# Altium schematic sheet LCD.SchDoc: LCD Interface
size A3; Author: P.A.; CompanyName: STMicroelectronics; Organization: Microcontrollers Division; Address1: 12, Rue Jules HOROWITZ; Address2: 38019 Grenoble; Address3: FRANCE; DocumentNumber: MB1261; Revision: B.01; SheetNumber: 9; SheetTotal: 15; Project: STM32L496G-DISCO
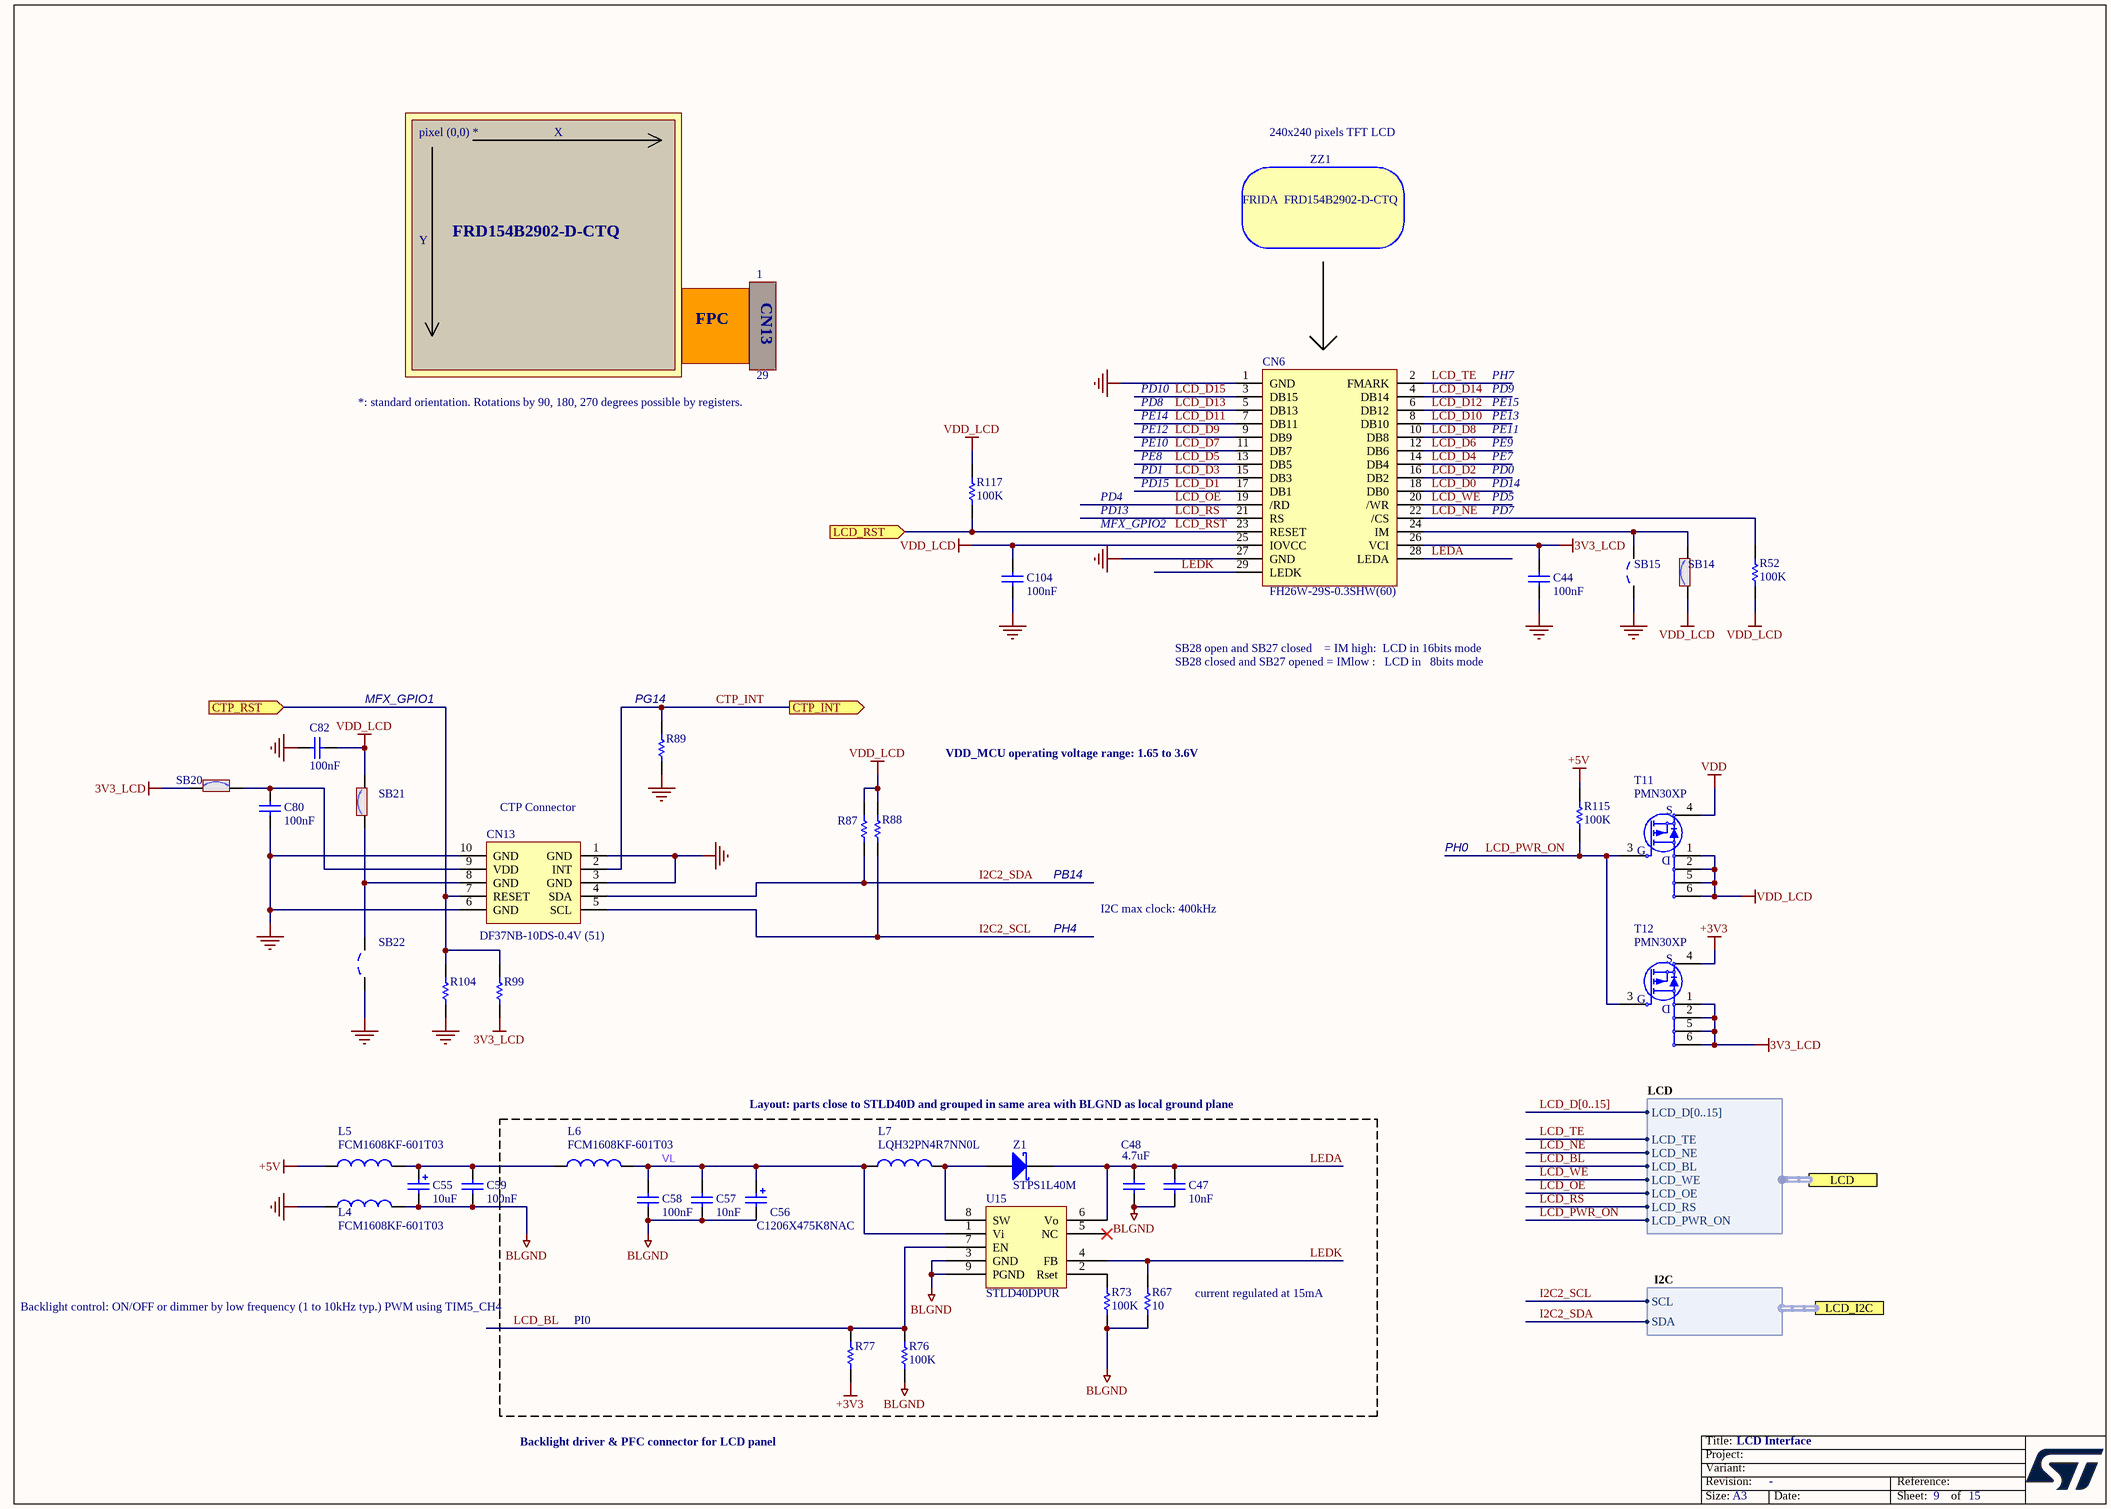
[diagram p0: LCD.SchDoc]

## Parts
C44  value 100nF  [0603C]  (hidden comment: CC0603KRX7R7BB104)
C47  value 10nF  [0603C]  (hidden comment: CC0603KRX7R9BB103)
C48  value 4.7uF  [1206C]  (hidden comment: CC1206KKX7R9BB475)
C55  value 10uF  [TAN-A]  (hidden comment: TAJA106K016R)
C56  C1206X475K8NAC  [1206C]
C57  value 10nF  [0603C]  (hidden comment: CC0603KRX7R9BB103)
C58  value 100nF  [0603C]  (hidden comment: CC0603KRX7R7BB104)
C59  value 100nF  [0603C]  (hidden comment: CC0603KRX7R7BB104)
C80  value 100nF  [0603C]  (hidden comment: CC0603KRX7R7BB104)
C82  value 100nF  [0603C]  (hidden comment: CC0603KRX7R7BB104)
C104  value 100nF  [0603C]  (hidden comment: CC0603KRX7R7BB104)
CN6  FH26W-29S-0.3SHW(60)  [FH26-29S-0R3SHW]
CN13  DF37NB-10DS-0.4V (51)  [DF37NB-10DS-0R4V]
L4  FCM1608KF-601T03  [0603L]
L5  FCM1608KF-601T03  [0603L]
L6  FCM1608KF-601T03  [0603L]
L7  LQH32PN4R7NN0L  [1210L]
R52  value 100K  [0603R]  (hidden comment: RC0603FR-07100KL)
R67  value 10  [0603R]  (hidden comment: RC0603FR-0710RL)
R73  value 100K  [0603R]  (hidden comment: RC0603FR-07100KL)
R76  value 100K  [0603R]  (hidden comment: RC0603FR-07100KL)
R77  (no value)  [0603R]
R87  (no value)  [0603R]
R88  (no value)  [0603R]
R89  (no value)  [0603R]
R99  (no value)  [0603R]
R104  (no value)  [0603R]
R115  value 100K  [0603R]  (hidden comment: RC0603FR-07100KL)
R117  value 100K  [0603R]  (hidden comment: RC0603FR-07100KL)
SB14  Solder Bridge ON  [SB_0603]  (value not drawn)
SB15  Solder Bridge OFF  [SB_0603]  (value not drawn)
SB20  Solder Bridge ON  [SB_0603]  (value not drawn)
SB21  Solder Bridge ON  [SB_0603]  (value not drawn)
SB22  Solder Bridge OFF  [SB_0603]  (value not drawn)
T11  PMN30XP  [MOS_SOT23-6L]
T12  PMN30XP  [MOS_SOT23-6L]
U15  STLD40DPUR  [SON8_0R65_3X3]
Z1  STPS1L40M  [DO-216AA]
ZZ1  FRIDA  FRD154B2902-D-CTQ  [LCD_FRD154BP2902-CTP]

## Ports
CTP_INT (out), CTP_RST (in), LCD (harness LCD), LCD_I2C (harness I2C), LCD_RST (in)

## Harnesses
LCD: LCD_NE, LCD_BL, LCD_WE, LCD_OE, LCD_D[0..15], LCD_RS, LCD_PWR_ON, LCD_TE
I2C: SDA, SCL

## Nets
3V3_LCD: C44.1 CN6.26(VCI) R99.2 SB20.1 T12.1(S) T12.2(S) T12.5(D) T12.6(D)
+3V3: R77.2 T12.4(S)
+5V: L5.1 R115.1
BLGND: C47.2 C48.2 C55.2 C56.2 C57.2 C58.2 C59.2 L4.2 R67.2 R73.2 R76.2 U15.3(GND) U15.9(PGND)
GND: C44.2 C80.2 C82.2 C104.2 CN6.1(GND) CN6.27(GND) CN13.1(GND) CN13.3(GND) CN13.6(GND) CN13.10(GND) L4.1 R89.2 R104.2 SB15.1 SB22.1
VDD: T11.4(S)
VDD_LCD: C82.1 C104.1 CN6.25(IOVCC) R52.2 R87.2 R88.1 R117.1 SB14.1 SB21.2 T11.1(S) T11.2(S) T11.5(D) T11.6(D)
CTP_INT: CN13.2(INT) R89.1 ; port CTP_INT
CTP_RST: CN13.7(RESET) R99.1 R104.1 ; port CTP_RST
I2C2_SCL: CN13.5(SCL) R88.2 ; port LCD_I2C.SCL
I2C2_SDA: CN13.4(SDA) R87.1 ; port LCD_I2C.SDA
LCD_BL: R76.1 R77.1 U15.7(EN) ; port LCD.LCD_BL
LCD_D0: CN6.18(DB0)
LCD_D1: CN6.17(DB1)
LCD_D2: CN6.16(DB2)
LCD_D3: CN6.15(DB3)
LCD_D4: CN6.14(DB4)
LCD_D5: CN6.13(DB5)
LCD_D6: CN6.12(DB6)
LCD_D7: CN6.11(DB7)
LCD_D8: CN6.10(DB8)
LCD_D9: CN6.9(DB9)
LCD_D10: CN6.8(DB10)
LCD_D11: CN6.7(DB11)
LCD_D12: CN6.6(DB12)
LCD_D13: CN6.5(DB13)
LCD_D14: CN6.4(DB14)
LCD_D15: CN6.3(DB15)
LCD_NE: CN6.22(/CS) R52.1 ; port LCD.LCD_NE
LCD_OE: CN6.19(/RD) ; port LCD.LCD_OE
LCD_PWR_ON: R115.2 T11.3(G) T12.3(G) ; port LCD.LCD_PWR_ON
LCD_RS: CN6.21(RS) ; port LCD.LCD_RS
LCD_RST: CN6.23(RESET) R117.2 ; port LCD_RST
LCD_TE: CN6.2(FMARK) ; port LCD.LCD_TE
LCD_WE: CN6.20(/WR) ; port LCD.LCD_WE
LEDA: C47.1 C48.1 CN6.28(LEDA) U15.6(Vo) Z1.2(K)
LEDK: CN6.29(LEDK) R67.1 U15.4(FB)
VL: C56.1 C57.1 C58.1 L6.2 L7.1 U15.1(Vi)
NetC55_1: C55.1 C59.1 L5.2 L6.1
NetC80_1: C80.1 CN13.9(VDD) SB20.2
NetCN6_24: CN6.24(IM) SB14.2 SB15.2
NetCN13_8: CN13.8(GND) SB21.1 SB22.2
NetL7_2: L7.2 U15.8(SW) Z1.1(A)
NetR73_1: R73.1 U15.2(Rset)

Not connected (* = marked no-connect by the designer): U15 5(NC)*

## Buses and harness runs
bus LCD_D[0..15]

## Notes on the sheet
- pixel (0,0) *
- X
- 240x240 pixels TFT LCD
- Y
- FRD154B2902-D-CTQ
- 1
- CN13
- FPC
- 29
- PH7
- *: standard orientation. Rotations by 90, 180, 270 degrees possible by registers.
- PE10
- PE12
- PE14
- PD8
- PD10
- PE9
- PE11
- PE13
- PE15
- PD9
- PD4
- PD13
- PD15
- PD1
- PE8
- PD7
- PD5
- PD14
- PD0
- PE7
- MFX_GPIO2
- MFX_GPIO1
- (near R89) PG14
- SB28 open and SB27 closed    = IM high:  LCD in 16bits mode
  SB28 closed and SB27 opened = IMlow :   LCD in   8bits mode
- VDD_MCU operating voltage range: 1.65 to 3.6V
- (near CN13) CTP Connector
- PH0
- PB14
- I2C max clock: 400kHz
- PH4
- Layout: parts close to STLD40D and grouped in same area with BLGND as local ground plane
- Backlight control: ON/OFF or dimmer by low frequency (1 to 10kHz typ.) PWM using TIM5_CH4
- PI0
- (near R67) current regulated at 15mA
- Backlight driver & PFC connector for LCD panel
- Title:
- Project:
- Size:
- Revision:
- Variant:
- A3
- -
- Date:
- Reference:
- Sheet:
- of

## Library data of the parts
C44 C58 C59 C80 C82 C104 = Cap: Capacitor,100nF,10%,16V,X7R,0603,YAGEO; Ordered by: Subcon; Published: 8-Jun-2000; Revision: July-2002: Re-released for DXP Platform.; Publisher: Altium Limited; Manuf_1: YAGEO; Manuf_Part_1: CC0603KRX7R7BB104
C47 C57 = Cap: Capacitor,10nF,0603,50V,10%,X7R,YAGEO;; Ordered by: Subcon; Published: 8-Jun-2000; Revision: July-2002: Re-released for DXP Platform.; Publisher: Altium Limited; Manuf_1: YAGEO; Manuf_Part_1: CC0603KRX7R9BB103
C48 = CAP: Capacitor,4.7uF,50V,X7R,10%,1206; Manuf_1: YAGEO; Ordered by: Subcon; ECCN_US/EU: NA; Published: 8-Jun-2000; Revision: July-2002: Re-released for DXP Platform.; Publisher: Altium Limited; Manuf_Part_1: CC1206KKX7R9BB475
C55 = Cap Pol1: TAN Capacitor,10uF,10%,16V,A Type,AVX; Ordered by: Subcon; ECCN_US/EU: NA; Published: 8-Jun-2000; Revision: July-2002: Re-released for DXP Platform.; Publisher: Altium Limited; Manuf_1: AVX; Manuf_Part_1: TAJA106K016R
C56 = Cap Pol1: Capacitor,4.7uF,±10%,X7R,10V,1206,C1206X475K8NAC; Manuf_1: Kemet; Ordered by: Subcon; ECCN_US/EU: NA; Published: 8-Jun-2000; Revision: July-2002: Re-released for DXP Platform.; Publisher: Altium Limited; Value: 4.7uF; Manuf_Part_1: C1206X475K8NAC
CN6 = FH26-29S-0.3SHW: 29pins FPC connector; Manuf_1: Hirose; Ordered by: Subcon; ECCN_US/EU: NA; Manuf_Part_1: FH26W-29S-0.3SHW(60)
CN13 = Header 5X2A: Header, 5-Pin, Dual row; Manuf_1: Hirose; Ordered by: Subcon; ECCN_US/EU: NA; LatestRevisionDate: 17-Jul-2002; LatestRevisionNote: Re-released for DXP Platform.; Publisher: Altium Limited; Manuf_Part_1: DF37NB-10DS-0.4V (51)
L4-L6 = Inductor: 100uH Bead; Manuf_1: Tai-tech; Ordered by: Subcon; ECCN_US/EU: NA; Published: 8-Jun-2000; Revision: July-2002: Re-released for DXP Platform.; Publisher: Altium Limited; Value: 100uH; Manuf_Part_1: FCM1608KF-601T03
L7 = Inductor: IND,4.7uH,1A,1210,LQH32PN4R7NN0L; Manuf_1: Murata; Value: 100uH; Ordered by: Subcon; ECCN_US/EU: NA; Published: 8-Jun-2000; Revision: July-2002: Re-released for DXP Platform.; Publisher: Altium Limited; Manuf_Part_1: LQH32PN4R7NN0L
R52 R73 R76 R115 R117 = res1: Resistor,100K,0603,1%,YAGEO; Ordered by: Subcon; ECCN_US/EU: NA; Published: 8-Jun-2000; Revision: July-2002: Re-released for DXP Platform.; Publisher: Altium Limited; Manuf_1: YAGEO; Manuf_Part_1: RC0603FR-07100KL
R67 = res1: Resistor,10R,0603,1%,YAGEO; Ordered by: Subcon; ECCN_US/EU: NA; Published: 8-Jun-2000; Revision: July-2002: Re-released for DXP Platform.; Publisher: Altium Limited; Manuf_1: YAGEO; Manuf_Part_1: RC0603FR-0710RL
R77 R89 R99 R104 = res1: Resistor,100K,0603,1%,YAGEO; Manuf_Part_1: RC0603FR-07100KL; Ordered by: Subcon; ECCN_US/EU: NA; Published: 8-Jun-2000; Revision: July-2002: Re-released for DXP Platform.; Publisher: Altium Limited; Value: 100K; Manuf_1: YAGEO
R87 R88 = res1: Resistor,1.5K,0603,1%,YAGEO; Manuf_Part_1: RC0603FR-071K5L; Value: 1K5; Ordered by: Subcon; ECCN_US/EU: NA; Published: 8-Jun-2000; Revision: July-2002: Re-released for DXP Platform.; Publisher: Altium Limited; Manuf_1: YAGEO
SB14 SB20 SB21 = SB_ON: Manuf_1: YAGEO; Manuf_Part_1: RC0603JR-070RL; Solder: YES; Ordered By: Subcon; Revision: July-2002: Re-released for DXP Platform.; ECCN_US/EU: N/A
SB15 SB22 = SB_OFF: Solder: NO; Revision: July-2002: Re-released for DXP Platform.; ECCN_US/EU: N/A
T11 T12 = MCD-01926: 20 V, P-channel Trench MOSFET; Part_Type: IC; Part_Preference: Recommended; Manufacturer: NEXPERIA; Order_Code_RS: 153-0671; Internal_Part_Number: MCD-01926; Value: PMN30XP; Status: Checked; Manufacturer_Part_Number: PMN30XP; Alternate_Manufacturer: N/A; Alternate_Manufacturer_Part_Number: N/A; Package: TSOP6; ComponentLink1URL: http://tunmcdsvn.tun.st.com/Component_Datasheet_Library/Trunk/IC/NEXPERIA_P_Channel_MOSFET_PMN30XP; Order_Code_Digikey: 1727-2699-1-ND; Order_Code_Farnell: 2545273
U15 = STLD40DPMR: Manuf_1: ST; Ordered by: STM; Ref St: 9176009; ECCN_US/EU: EAR99/NEC; Manuf_Part_1: STLD40DPUR
Z1 = D Schottky: Schottky Diode; Code - JEDEC: DO-214-AA; Ordered by: STM; Ref St: 9151085; ECCN_US/EU: EAR99/NEC; Published: 8-Jun-2000; Revision: July-2002: Re-released for DXP Platform.; Publisher: Altium Limited; Manuf_1: STM; Manuf_Part_1: STPS1L40M
ZZ1 = BoM_Item: Manuf_Part_1: FRIDA LCD FRD154BP2901; Ordered by: Subcon; ECCN_US/EU: EAR99/NEC; Manuf_1: FRIDA